# Altium schematic sheet Tractive System Schematic.SchDoc
size A3; SheetNumber: 1; SheetTotal: 2
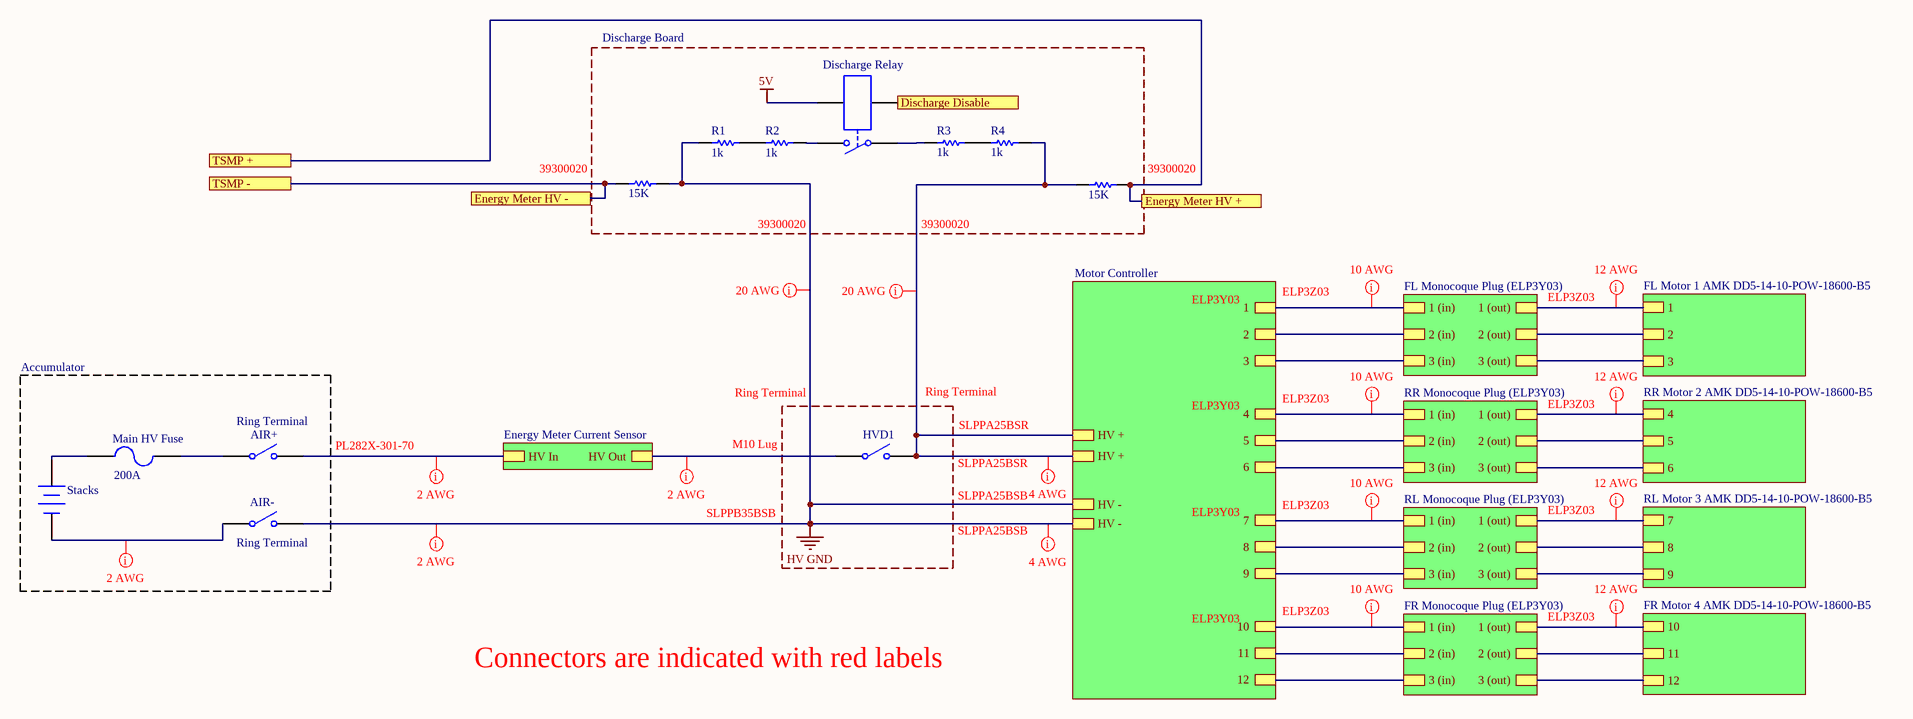
[diagram p0: Tractive System Schematic.SchDoc]

## Parts
AIR+  (no value)  [SPST-2]
AIR-  (no value)  [SPST-2]
Discharge_Relay  (no value)  [MODULE4]
HVD1  (no value)  [SPST-2]
Main_HV_Fuse  200A  [PIN-W2/E2.8]
R1  1k  [B TO-263]
R2  1k  [B TO-263]
R3  1k  [B TO-263]
R4  1k  [B TO-263]
R5  15K  [0805]
R6  15K  [0805]
Stacks  (no value)  [BAT-2]

## Blocks framed on the sheet
Ring Terminal: HVD1

## Sub-sheets
Energy Meter Current Sensor = File Name: HV Out, HV In
FL Monocoque Plug (ELP3Y03) = File Name: 1 (in), 2 (in), 3 (in), 3 (out), 2 (out), 1 (out)
FL Motor 1 AMK DD5-14-10-POW-18600-B5 = File Name: 2, 3, 1
FR Monocoque Plug (ELP3Y03) = File Name: 1 (in), 2 (in), 3 (in), 3 (out), 2 (out), 1 (out)
FR Motor 4 AMK DD5-14-10-POW-18600-B5 = File Name: 10, 11, 12
Motor Controller = File Name: HV +, HV -, 1, 2, 3, 4, 5, 6, 7, 8, 9, 10, 11, 12, HV +, HV -
RL Monocoque Plug (ELP3Y03) = File Name: 1 (in), 2 (in), 3 (in), 3 (out), 2 (out), 1 (out)
RL Motor 3 AMK DD5-14-10-POW-18600-B5 = File Name: 7, 8, 9
RR Monocoque Plug (ELP3Y03) = File Name: 1 (in), 2 (in), 3 (in), 3 (out), 2 (out), 1 (out)
RR Motor 2 AMK DD5-14-10-POW-18600-B5 = File Name: 4, 5, 6

## Ports
Discharge Disable, Energy Meter HV +, Energy Meter HV -, TSMP +, TSMP -

## Nets
5V: Discharge_Relay.4
HV GND: AIR-.2(NO) R1.1 R5.2 ; sheet Motor Controller/HV -, sheet Motor Controller/HV -
Discharge Disable: Discharge_Relay.3 ; port Discharge Disable
Energy Meter HV +: R6.2 ; port TSMP +, port Energy Meter HV +
Energy Meter HV -: R5.1 ; port TSMP -, port Energy Meter HV -
NetAIR+_1: AIR+.1(COMMON) Main_HV_Fuse.2
NetAIR+_2: AIR+.2(NO) ; sheet Energy Meter Current Sensor/HV In
NetAIR-_1: AIR-.1(COMMON) Stacks.2(-)
NetDischarge_Relay_1: Discharge_Relay.1 R3.1
NetDischarge_Relay_2: Discharge_Relay.2 R2.2
NetHVD1_1: HVD1.1(COMMON) ; sheet Energy Meter Current Sensor/HV Out
NetHVD1_2: HVD1.2(NO) R4.2 R6.1 ; sheet Motor Controller/HV +, sheet Motor Controller/HV +
NetMain_HV_Fuse_1: Main_HV_Fuse.1 Stacks.1(+)
NetR1_2: R1.2 R2.1
NetR3_2: R3.2 R4.1
(unnamed): sheet Motor Controller/1, sheet FL Monocoque Plug (ELP3Y03)/1 (in)
(unnamed): sheet Motor Controller/2, sheet FL Monocoque Plug (ELP3Y03)/2 (in)
(unnamed): sheet Motor Controller/3, sheet FL Monocoque Plug (ELP3Y03)/3 (in)
(unnamed): sheet Motor Controller/4, sheet RR Monocoque Plug (ELP3Y03)/1 (in)
(unnamed): sheet Motor Controller/5, sheet RR Monocoque Plug (ELP3Y03)/2 (in)
(unnamed): sheet Motor Controller/6, sheet RR Monocoque Plug (ELP3Y03)/3 (in)
(unnamed): sheet Motor Controller/7, sheet RL Monocoque Plug (ELP3Y03)/1 (in)
(unnamed): sheet Motor Controller/8, sheet RL Monocoque Plug (ELP3Y03)/2 (in)
(unnamed): sheet Motor Controller/9, sheet RL Monocoque Plug (ELP3Y03)/3 (in)
(unnamed): sheet Motor Controller/10, sheet FR Monocoque Plug (ELP3Y03)/1 (in)
(unnamed): sheet Motor Controller/11, sheet FR Monocoque Plug (ELP3Y03)/2 (in)
(unnamed): sheet Motor Controller/12, sheet FR Monocoque Plug (ELP3Y03)/3 (in)
(unnamed): sheet FL Motor 1 AMK DD5-14-10-POW-18600-B5/2, sheet FL Monocoque Plug (ELP3Y03)/2 (out)
(unnamed): sheet FL Motor 1 AMK DD5-14-10-POW-18600-B5/3, sheet FL Monocoque Plug (ELP3Y03)/3 (out)
(unnamed): sheet FL Motor 1 AMK DD5-14-10-POW-18600-B5/1, sheet FL Monocoque Plug (ELP3Y03)/1 (out)
(unnamed): sheet RR Motor 2 AMK DD5-14-10-POW-18600-B5/4, sheet RR Monocoque Plug (ELP3Y03)/1 (out)
(unnamed): sheet RR Motor 2 AMK DD5-14-10-POW-18600-B5/5, sheet RR Monocoque Plug (ELP3Y03)/2 (out)
(unnamed): sheet RR Motor 2 AMK DD5-14-10-POW-18600-B5/6, sheet RR Monocoque Plug (ELP3Y03)/3 (out)
(unnamed): sheet RL Motor 3 AMK DD5-14-10-POW-18600-B5/7, sheet RL Monocoque Plug (ELP3Y03)/1 (out)
(unnamed): sheet RL Motor 3 AMK DD5-14-10-POW-18600-B5/8, sheet RL Monocoque Plug (ELP3Y03)/2 (out)
(unnamed): sheet RL Motor 3 AMK DD5-14-10-POW-18600-B5/9, sheet RL Monocoque Plug (ELP3Y03)/3 (out)
(unnamed): sheet FR Motor 4 AMK DD5-14-10-POW-18600-B5/10, sheet FR Monocoque Plug (ELP3Y03)/1 (out)
(unnamed): sheet FR Motor 4 AMK DD5-14-10-POW-18600-B5/11, sheet FR Monocoque Plug (ELP3Y03)/2 (out)
(unnamed): sheet FR Motor 4 AMK DD5-14-10-POW-18600-B5/12, sheet FR Monocoque Plug (ELP3Y03)/3 (out)

## Layout directives
mark named 2 AWG: HV GND, NetAIR+_2, NetAIR-_1, NetHVD1_1
mark named 20 AWG: HV GND, NetHVD1_2
mark named 10 AWG: (no net found under the mark)
mark named 4 AWG: HV GND, NetHVD1_2
mark named 12 AWG: (no net found under the mark)

## Notes on the sheet
- Discharge Board
- (near Discharge_Relay) Discharge Relay
- (near R5) 39300020
- (near R6) 39300020
- 39300020
- ELP3Y03
- ELP3Z03
- Accumulator
- (near AIR+) Ring Terminal
- Ring Terminal
- SLPPA25BSR
- PL282X-301-70
- M10 Lug
- SLPPA25BSB
- (near AIR-) Ring Terminal
- SLPPB35BSB
- Connectors are indicated with red labels

## Library data of the parts
AIR+ AIR- HVD1 = SW-SPST: Single-Pole, Single-Throw Switch; Published: 24-Mar-1999; LatestRevisionDate: 17-Jul-2002; LatestRevisionNote: Re-released for DXP Platform.; PackageReference: SPST-2; Publisher: Altium Limited; PackageDescription: Switch; 2 Leads
Discharge_Relay = Relay-SPST: Single-Pole Single-Throw Relay; Published: 24-Mar-1999; LatestRevisionDate: 17-Jul-2002; LatestRevisionNote: Re-released for DXP Platform.; PackageReference: MODULE4; Publisher: Altium Limited
Main_HV_Fuse = Fuse 2: Fuse; Published: 8-Jun-2000; LatestRevisionDate: 17-Jul-2002; LatestRevisionNote: Re-released for DXP Platform.; PackageReference: PIN-W2/E2.8; Publisher: Altium Limited; PackageDescription: Thru-Hole; 2 Leads
R1-R4 = PWR263S-35-1001J: Manufacturer: Bournes Inc; Tolerance: 0.05; Rated Voltage: 35W; Part Number: PWR263S-35-1001J; Value: 1k; Digikey Part Number: PWR263S-35-1001J-ND
R5 R6 = CMP-037-000330-3: RC0805FR0715KL; Rated Voltage: 0.125W; Tolerance: 0.01; Value: 15k; Digikey Part Number: 311-15.0KCRCT-ND; Material: FR-07
Stacks = Battery: Multicell Battery; Published: 24-Mar-1999; LatestRevisionDate: 17-Jul-2002; LatestRevisionNote: Re-released for DXP Platform.; PackageReference: BAT-2; Publisher: Altium Limited; PackageDescription: Battery; 2 Leads